# Altium schematic sheet Sheet3.SchDoc
size A4; SheetNumber: 2; SheetTotal: 3
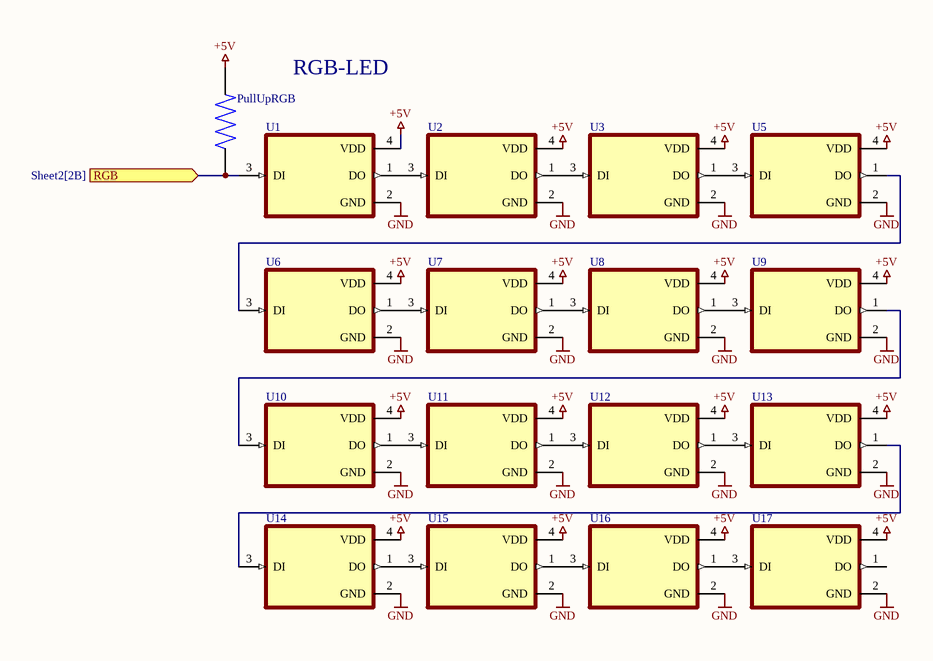
[diagram p0: Sheet3.SchDoc]

## Parts
PullUpRGB  CRG0402F4K7  [RESC1005X40N]  (value not drawn)
U1  WS2812-2020  [LED_WS2812-2020]  (value not drawn)
U2  WS2812-2020  [LED_WS2812-2020]  (value not drawn)
U3  WS2812-2020  [LED_WS2812-2020]  (value not drawn)
U5  WS2812-2020  [LED_WS2812-2020]  (value not drawn)
U6  WS2812-2020  [LED_WS2812-2020]  (value not drawn)
U7  WS2812-2020  [LED_WS2812-2020]  (value not drawn)
U8  WS2812-2020  [LED_WS2812-2020]  (value not drawn)
U9  WS2812-2020  [LED_WS2812-2020]  (value not drawn)
U10  WS2812-2020  [LED_WS2812-2020]  (value not drawn)
U11  WS2812-2020  [LED_WS2812-2020]  (value not drawn)
U12  WS2812-2020  [LED_WS2812-2020]  (value not drawn)
U13  WS2812-2020  [LED_WS2812-2020]  (value not drawn)
U14  WS2812-2020  [LED_WS2812-2020]  (value not drawn)
U15  WS2812-2020  [LED_WS2812-2020]  (value not drawn)
U16  WS2812-2020  [LED_WS2812-2020]  (value not drawn)
U17  WS2812-2020  [LED_WS2812-2020]  (value not drawn)

## Ports
RGB (in, see Sheet2[2B])

## Nets
+5V: PullUpRGB.2 U1.4(VDD) U2.4(VDD) U3.4(VDD) U5.4(VDD) U6.4(VDD) U7.4(VDD) U8.4(VDD) U9.4(VDD) U10.4(VDD) U11.4(VDD) U12.4(VDD) U13.4(VDD) U14.4(VDD) U15.4(VDD) U16.4(VDD) U17.4(VDD)
GND: U1.2(GND) U2.2(GND) U3.2(GND) U5.2(GND) U6.2(GND) U7.2(GND) U8.2(GND) U9.2(GND) U10.2(GND) U11.2(GND) U12.2(GND) U13.2(GND) U14.2(GND) U15.2(GND) U16.2(GND) U17.2(GND)
RGB: PullUpRGB.1 U1.3(DI) ; port RGB
NetU1_1: U1.1(DO) U2.3(DI)
NetU2_1: U2.1(DO) U3.3(DI)
NetU3_1: U3.1(DO) U5.3(DI)
NetU5_1: U5.1(DO) U6.3(DI)
NetU6_1: U6.1(DO) U7.3(DI)
NetU7_1: U7.1(DO) U8.3(DI)
NetU8_1: U8.1(DO) U9.3(DI)
NetU9_1: U9.1(DO) U10.3(DI)
NetU10_1: U10.1(DO) U11.3(DI)
NetU11_1: U11.1(DO) U12.3(DI)
NetU12_1: U12.1(DO) U13.3(DI)
NetU13_1: U13.1(DO) U14.3(DI)
NetU14_1: U14.1(DO) U15.3(DI)
NetU15_1: U15.1(DO) U16.3(DI)
NetU16_1: U16.1(DO) U17.3(DI)

Not connected (* = marked no-connect by the designer): U17 1(DO)

## Notes on the sheet
- RGB-LED

## Library data of the parts
PullUpRGB = CRG0402F4K7: Thick Film Smnt Resistor 0402 Case 4.7kOhm +/-1% 0.063W +/-100ppm/degC | TE Connectivity CRG0402F4K7; Power_Rating: .063 W; Resistance: 10k; Voltage_Rating: 50 V; Tolerance: 1%; SnapEDA_Link: https://www.snapeda.com/parts/CRG0402F4K7/TE+Connectivity+Passive+Product/view-part/?ref=snap; Package: 0402; Value: *; MF: TE Connectivity; MP: CRG0402F4K7; Check_prices: https://www.snapeda.com/parts/CRG0402F4K7/TE+Connectivity+Passive+Product/view-part/?ref=eda
U1-U3 U5-U17 = WS2812-2020: Intelligent control LED light source, SMD-4; MF: Worldsemi; MP: WS2812-2020; Availability: Not in stock; Package: Package; SnapEDA_Link: https://www.snapeda.com/parts/WS2812-2020/Worldsemi/view-part/?ref=snap; Check_prices: https://www.snapeda.com/parts/WS2812-2020/Worldsemi/view-part/?ref=eda; Value: *; Price: None
  U1: ComponentLink1Description: New link; ComponentLink1URL: *; Supplier 1: Mouser; Supplier Part Number 1: 485-1655